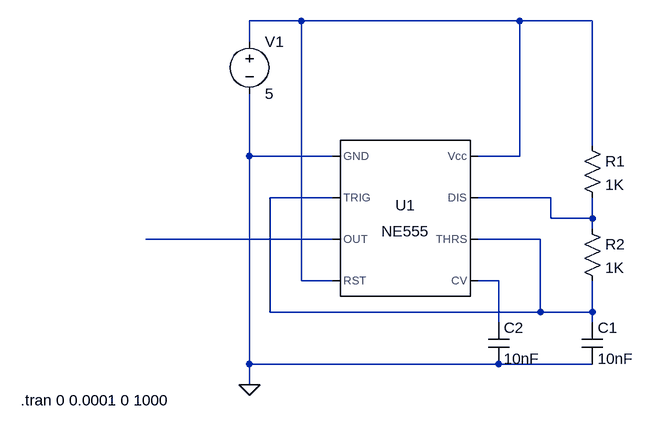
[diagram p0: schematic timer.asc]
timer.asc, the LTspice schematic file:
Version 4
SHEET 1 880 680
WIRE 16 -144 -64 -144
WIRE 352 -144 16 -144
WIRE 464 -144 352 -144
WIRE -64 -112 -64 -144
WIRE 464 48 464 -144
WIRE -64 64 -64 -32
WIRE 64 64 -64 64
WIRE 352 64 352 -144
WIRE 352 64 288 64
WIRE 64 128 -32 128
WIRE 400 128 288 128
WIRE 400 160 400 128
WIRE 464 160 464 128
WIRE 464 160 400 160
WIRE 464 176 464 160
WIRE 64 192 -224 192
WIRE 384 192 288 192
WIRE 16 256 16 -144
WIRE 64 256 16 256
WIRE 320 256 288 256
WIRE -32 304 -32 128
WIRE 384 304 384 192
WIRE 384 304 -32 304
WIRE 464 304 464 256
WIRE 464 304 384 304
WIRE 320 320 320 256
WIRE 464 320 464 304
WIRE -64 384 -64 64
WIRE 320 384 -64 384
WIRE 464 384 320 384
WIRE -64 416 -64 384
FLAG -64 416 0
SYMBOL Misc\\NE555 176 160 R0
SYMATTR InstName U1
SYMBOL voltage -64 -128 R0
WINDOW 123 0 0 Left 0
WINDOW 39 0 0 Left 0
SYMATTR InstName V1
SYMATTR Value 5
SYMBOL res 448 32 R0
SYMATTR InstName R1
SYMATTR Value 1K
SYMBOL res 448 160 R0
SYMATTR InstName R2
SYMATTR Value 1K
SYMBOL cap 304 320 R0
SYMATTR InstName C2
SYMATTR Value 10nF
SYMBOL cap 448 320 R0
SYMATTR InstName C1
SYMATTR Value 10nF
TEXT -416 440 Left 2 !.tran 0 0.0001 0 1000

The netlist it stands for:
* timer.asc
XU1 0 N002 N004 N001 N005 N002 N003 N001 NE555  ; pins GND TRIG OUT RST CV THRS DIS Vcc
V1 N001 0 5
R1 N001 N003 1K
R2 N003 N002 1K
C2 N005 0 10nF
C1 N002 0 10nF
.tran 0 0.0001 0 1000
.lib NE555.sub
.backanno
.end